# EAGLE design tiny-dcdc (EAGLE 6.2)
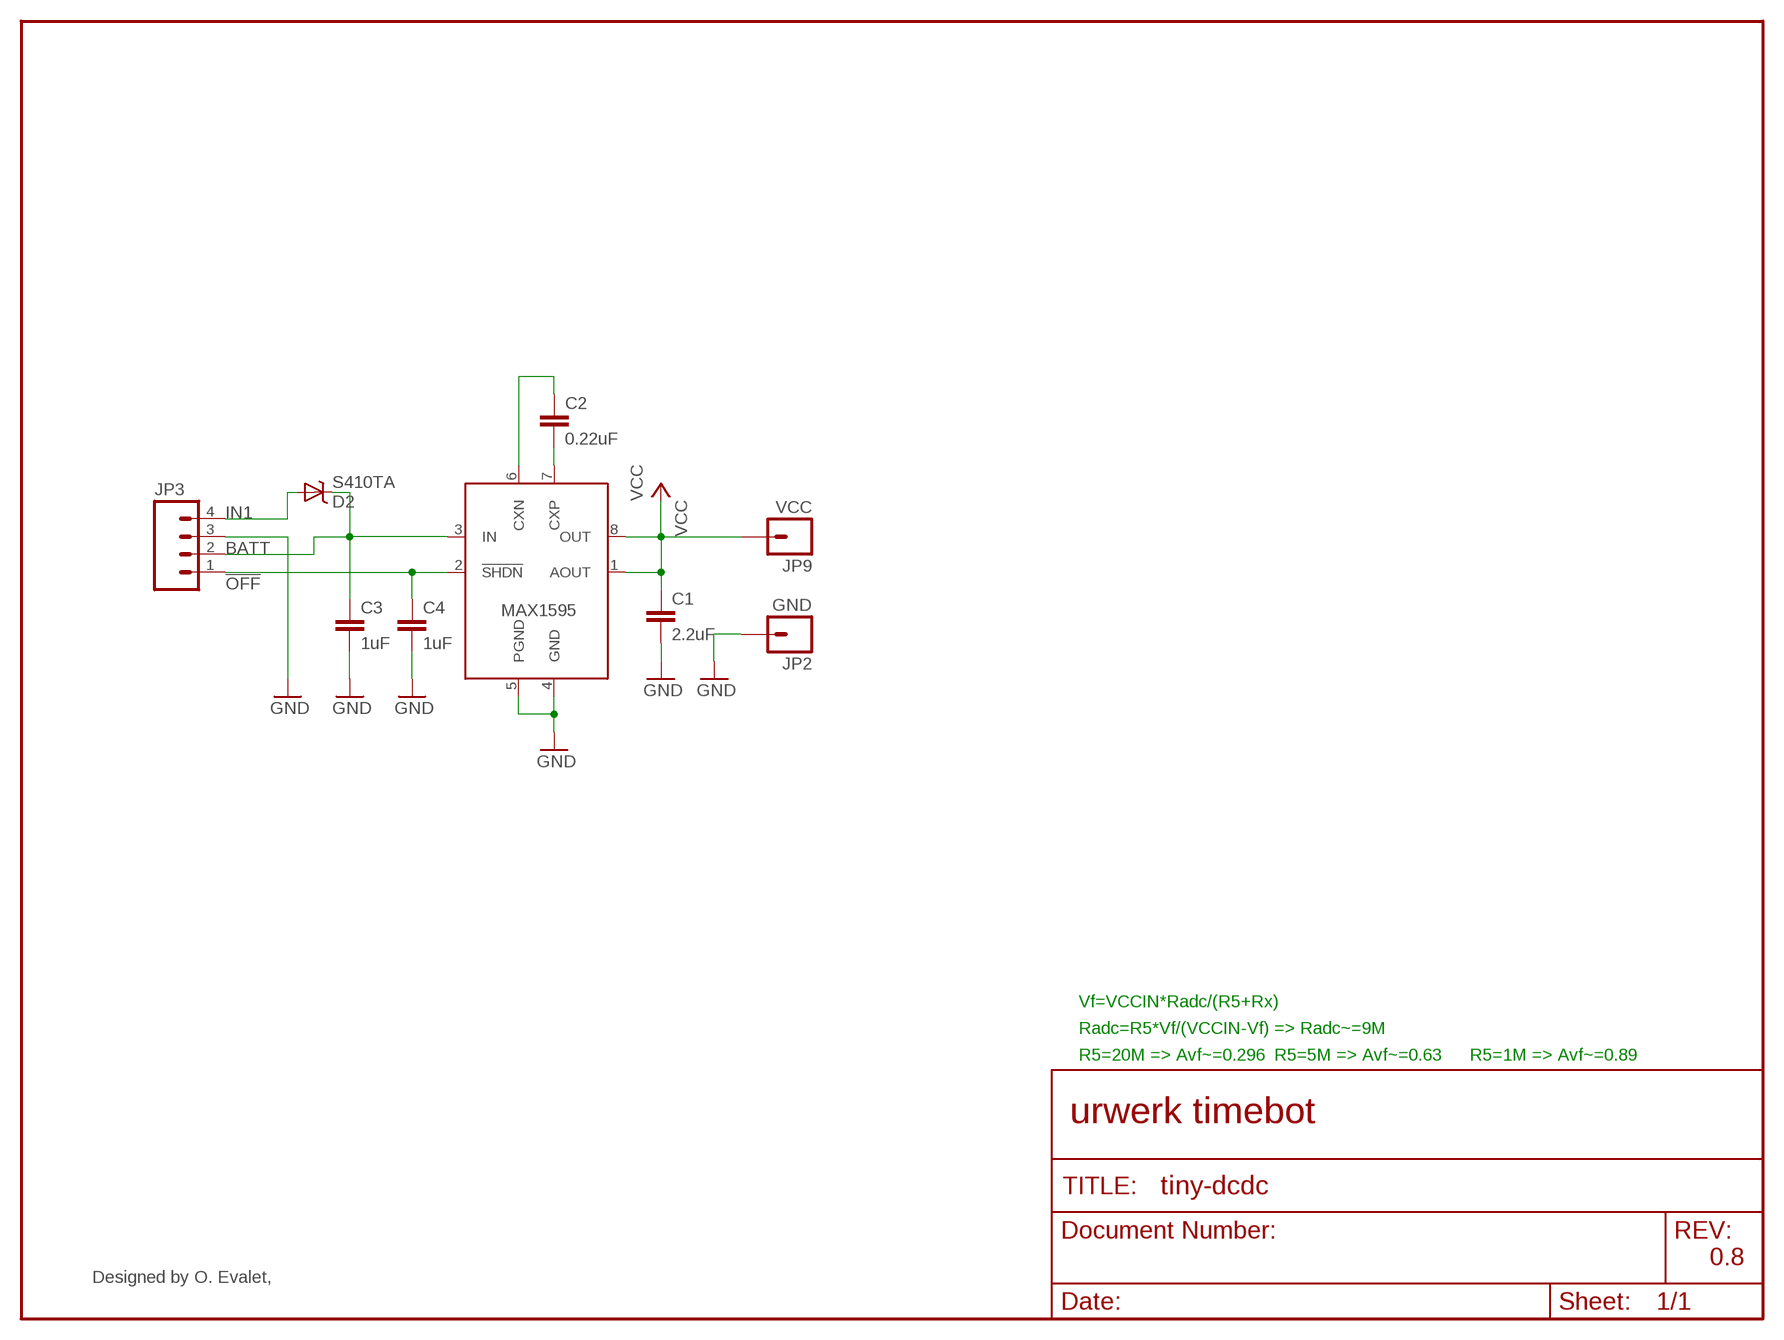
[diagram p0: schematic, sheet 1]

## Parts
C1  2.2uF  CAP0805  [0805]
C2  0.22uF  CAP0805  [0805]
C3  1uF  CAP0805  [0805]
C4  1uF  CAP0805  [0805]
D2  S410TA  DIODE-SCHOTTKY  [SOD-323]
JP2  GND  M01URWERK-ROUND  [URWERK1X01]
JP3  M041.27MM  [1X04-1.27MM]
JP9  VCC  M01SMALL  [URWERK1-SMALLX01]
U$1  MAX1595  [UMAX8]

## Nets
!OFF: C4.1 JP3.1 U$1.2(!SHDN)
BATT: C3.1 D2.1(C) JP3.2 U$1.3(IN)
GND: C1.2 C3.2 C4.2 JP2.1 JP3.3 U$1.4(GND) U$1.5(PGND)
IN1: D2.2(A) JP3.4
N$2: C2.2 U$1.7(CXP)
N$3: C2.1 U$1.6(CXN)
VCC: C1.1 JP9.1 U$1.1(AOUT) U$1.8(OUT)

## Notes on the sheet
- Vf=VCCIN*Radc/(R5+Rx)
- Radc=R5*Vf/(VCCIN-Vf) => Radc~=9M
- R5=20M => Avf~=0.296 | R5=5M => Avf~=0.63 | R5=1M => Avf~=0.89
- urwerk timebot
- 0.8
- Designed by O. Evalet,

## Library data of the parts
C1-C4 = 0-SparkFun:CAP: Capacitor Standard 0603 ceramic capacitor, and 0.1" leaded capacitor.
D2 = bicyclelab:DIODE-SCHOTTKY: ZLLS410 10V LOW LEAKAGE SCHOTTKY DIODE IN SOD323
JP2 JP9 = bicyclelab:M01: Header 1 Standard 1-pin 0.1" header. Use with straight break away headers (SKU : PRT-00116), right angle break away headers (PRT-00553), swiss pins (PRT-00743), machine pins (PRT-00117), and female headers (PRT-00115).
JP3 = 0-SparkFun:M04: Header 4 Standard 4-pin 0.1" header. Use with straight break away headers (SKU : PRT-00116), right angle break away headers (PRT-00553), swiss pins (PRT-00743), machine pins (PRT-00117), and female headers (PRT-00115). Molex polarized connector foot print use with SKU : PRT-08231 with associated crimp pins and housings. 1MM SMD Version SKU: PRT-10208
U$1 = bicyclelab:MAX1595

## Board
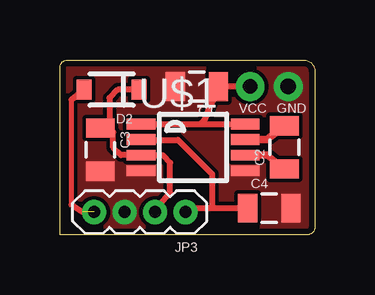
[diagram p1: board, top side]
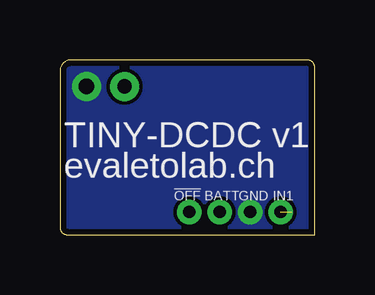
[diagram p2: board, bottom side, seen from below]

Size 10.64 x 7.3 mm. Coordinates in mm from the lower left corner, seen from the top.
Outline: 0,0 0,6.99 arc-90 0.32,7.3 10.16,7.3 arc-90 10.64,6.83 10.64,0.32 arc-90 10.32,0 0,0
Copper layers (1*16): Top 0.035mm / dielectric 1.5mm / Bottom 0.035mm
Design rules: minimum track width 6mil, minimum drill 12mil, track to track 6mil, track to pad 6mil, pad to pad 6mil, via to via 6mil, smd to smd 0mil, copper to edge 10mil, drill to drill 10mil, minimum pad ring 10mil, minimum via ring 6mil, stop-mask expansion 2mil, vias tented up to drill 100mil, thermal gap 10mil

### Footprints (pad centres in the part's own frame; a part is rotated, then mirrored left to right if it is on the bottom)
0805 = smd 0.8 x 1.2: 1 -0.9,0; 2 0.9,0
SOD-323 = smd 0.63 x 0.83: 1 -1.15,0; 2 1.15,0
URWERK1X01 = drill 0.65 pad 1.2: 1 0,0
1X04-1.27MM = drill 0.508 pad 1: 1 0,0; 2 1.27,0; 3 2.54,0; 4 3.81,0
URWERK1-SMALLX01 = drill 0.6 pad 1.2: 1 0,0
UMAX8 = smd 0.45 x 1.2: 1 -0.975,-2.175; 2 -0.325,-2.175; 3 0.325,-2.175; 4 0.975,-2.175; 5 0.975,2.175; 6 0.325,2.175; 7 -0.325,2.175; 8 -0.975,2.175

### Placement (x,y rotation side)
C1  5.71,6.19 180 top
C2  9.37,3.65 90 top
C3  1.69,3.56 270 top
C4  8.73,1.11 0 top
D2  2.16,6.06 180 top
JP2  9.53,6.19 0 top
JP3  5.24,0.95 180 top
JP9  7.94,6.19 0 top
U$1  5.56,3.65 270 top

### Tracks (layer width: path | path; a pad name or v marks a point on that pad's centre or on a via)
!OFF
  Top 0.254: U$1.2 3.07,3.97 4.92,3.97 6.35,2.54 6.35,1.11 | C4.1 6.35,1.11 | 6.35,1.11 5.4,1.11 JP3.1
BATT
  Top 0.254: C3.1 1.68,4.6 | D2.1 2.41,6.06 2.06,5.71 2.06,4.51 C3.1 | C3.1 1.86,4.29 2.22,4.29 2.22,3.65 2.55,3.33 U$1.3 4.29,3.33 4.6,3.02 4.6,1.75 4.13,1.27 4.13,1.11 JP3.2
GND
  pour Top (rank 2, no thermals): 0,0 10.64,0 10.64,7.3 0,7.3
  pour Bottom (no thermals): 0,0 10.64,0 10.64,7.3 0,7.3
IN1  (1 unrouted)
  Top 0.2: 0.48,5.63 0.48,1.27
  Top 0.254: D2.2 0.48,5.63 | 0.48,1.27 0.95,0.95
N$2
  Top 0.305: U$1.7 8.63,3.98 C2.2
N$3
  Top 0.305: U$1.6 8.63,3.33 C2.1
VCC
  Top 0.254: U$1.1 5.87,4.63 | 5.87,4.63 U$1.8 | C1.1 5.98,4.73 5.87,4.63 | JP9.1 C1.1 | C1.1

### Text on the board
tPlace: VCC | GND
bPlace: TINY-DCDC v1 | evaletolab.ch | IN1 | GND | BATT | !OFF